# EAGLE design 02 (EAGLE 6.6.0)
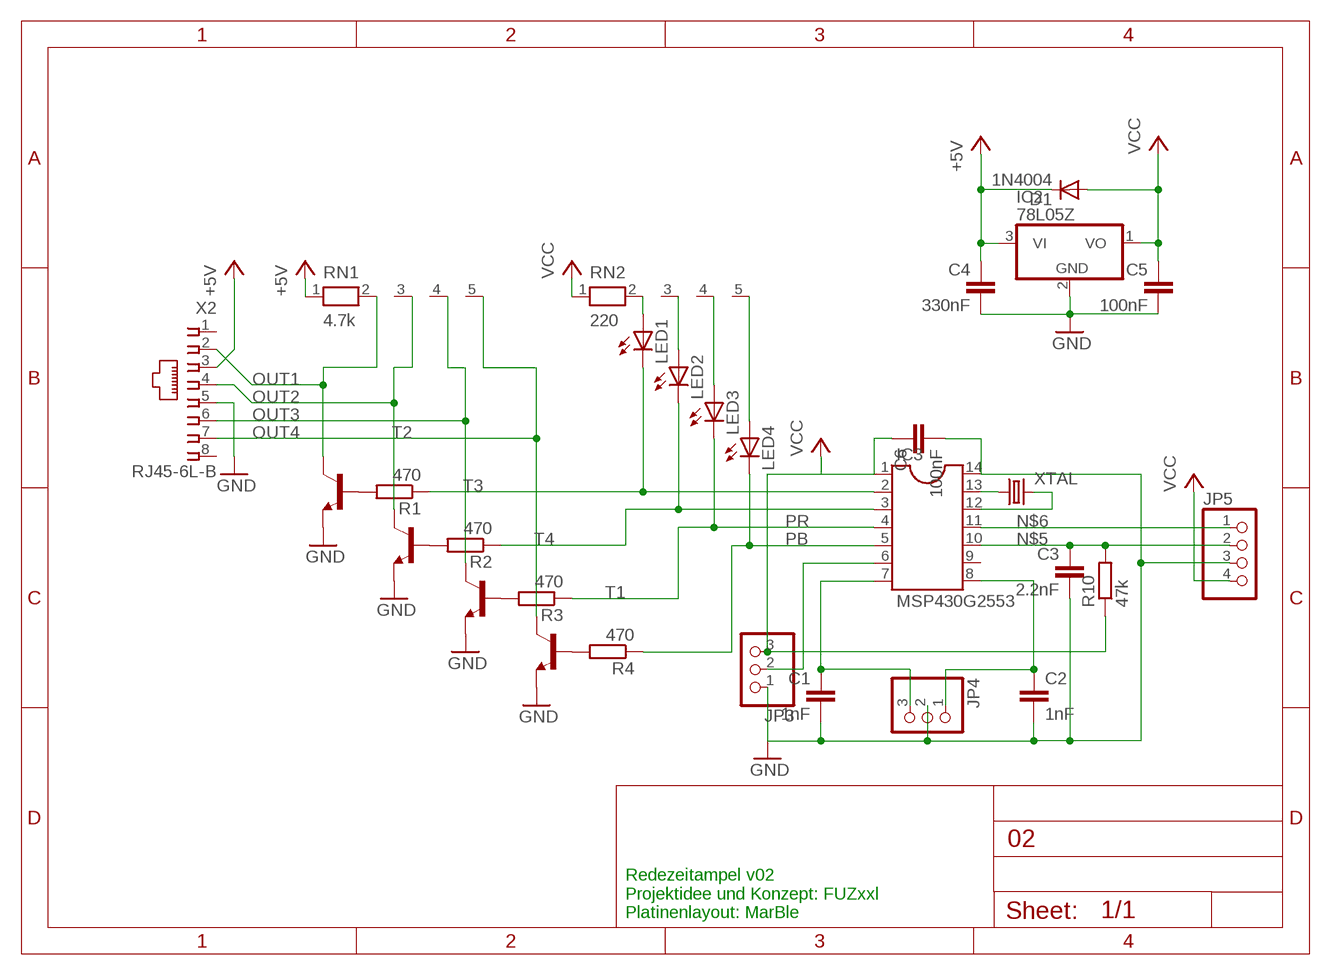
[diagram p0: schematic, sheet 1]

## Parts
C1  1nF  C-EU025-024X044  [C025-024X044]
C2  1nF  C-EU025-024X044  [C025-024X044]
C3  2.2nF  C-EU025-024X044  [C025-024X044]
C4  330nF  C-EU050-024X044  [C050-024X044]
C5  100nF  C-EU050-024X044  [C050-024X044]
C6  100nF  C-EU050-024X044  [C050-024X044]
D1  1N4004  [DO41-10]
IC2  78L05Z  [TO92]
IC3  MSP430G2553  DIL14S  [SOCKET-14]
JP3  PINHD-1X3  [1X03]
JP4  PINHD-1X3  [1X03]
JP5  PINHD-1X4  [1X04]
LED1  LED5MM  [LED5MM]
LED2  LED5MM  [LED5MM]
LED3  LED5MM  [LED5MM]
LED4  LED5MM  [LED5MM]
R1  470  R-EU_0207/12  [0207/12]
R2  470  R-EU_0207/12  [0207/12]
R3  470  R-EU_0207/12  [0207/12]
R4  470  R-EU_0207/12  [0207/12]
R10  47k  R-EU_0207/7  [0207/7]
RN1  4.7k  RN04  [RN-5]
RN2  220  RN04  [RN-5]
T1  -NPN-TO92-EBC  [TO92-EBC]
T2  -NPN-TO92-EBC  [TO92-EBC]
T3  -NPN-TO92-EBC  [TO92-EBC]
T4  -NPN-TO92-EBC  [TO92-EBC]
X2  RJ45-6L-B  [RJ45-NO-SHIELD]
XTAL  CRYSTALTC26H  [TC26H]

## Nets
+5V: C4.1 D1.C IC2.3(VI) RN1.1 X2.3
GND: C1.2 C2.2 C3.2 C4.2 C5.2 C6.2 IC2.2(GND) IC3.14 JP3.1 JP4.2 JP5.3 T1.E T2.E T3.E T4.E X2.5
N$1: IC3.6 JP3.2
N$2: IC3.13 XTAL.1
N$3: C1.1 IC3.7 JP4.3
N$4: C2.1 IC3.8 JP4.1
N$5: C3.1 IC3.10 JP5.2 R10.2
N$6: IC3.11 JP5.1
N$7: IC3.12 XTAL.2
N$8: LED1.A RN2.2
N$9: IC3.3 LED2.K(C) R2.1
N$10: LED2.A RN2.3
N$11: R4.2 T1.B
N$12: IC3.2 LED1.K(C) R1.1
N$13: LED3.A RN2.4
N$14: LED4.A RN2.5
N$16: R1.2 T2.B
N$20: R2.2 T3.B
N$23: R3.2 T4.B
OUT1: RN1.2 T2.C X2.2
OUT2: RN1.3 T3.C X2.4
OUT3: RN1.4 T4.C X2.6
OUT4: RN1.5 T1.C X2.7
PB: IC3.5 LED4.K(C) R4.1
PR: IC3.4 LED3.K(C) R3.1
VCC: C5.1 C6.1 D1.A IC2.1(VO) IC3.1 JP3.3 JP5.4 R10.1 RN2.1
Unconnected: IC3.9 X2.1 X2.8

## Notes on the sheet
- Redezeitampel v02
  Projektidee und Konzept: FUZxxl
  Platinenlayout: MarBle

## Library data of the parts
C1-C6 = rcl:C-EU: CAPACITOR, European symbol
D1 = adafruit:1N4004: DIODE General purpose 1N400x type rectifier (With bigger pads) http://www.ladyada.net/library/pcb/eaglelibrary.html
IC2 = linear:78*: Positive VOLTAGE REGULATOR Source: http://cache.national.com/ds/LM/LM78L05.pdf http://www.fairchildsemi.com/ds/LM/LM7805.pdf
IC3 = ic-package:DIL14: Dual In Line / Socket
JP3 JP4 = pinhead:PINHD-1X3: PIN HEADER
JP5 = pinhead:PINHD-1X4: PIN HEADER
LED1-LED4 = led:LED: LED OSRAM: - CHIPLED LG R971, LG N971, LY N971, LG Q971, LY Q971, LO R971, LY R971 LH N974, LH R974 LS Q976, LO Q976, LY Q976 LO Q996 - Hyper CHIPLED LW Q18S LB Q993, LB Q99A, LB R99A - SideLED LS A670, LO A670, LY A670, LG A670, LP A670 LB A673, LV A673, LT A673, LW A673 LH A674 LY A675 LS A676, LA A676, LO A676, LY A676, LW A676 LS A679, LY A679, LG A679 - Hyper Micro SIDELED® LS Y876, LA Y876, LO Y876, LY Y876 LT Y87S - SmartLED LW L88C, LW L88S LB L89C, LB L89S, LG L890 LS L89K, LO L89K, LY L89K LS L896, LA L896, LO L896, LY L896 - TOPLED LS T670, LO T670, LY T670, LG T670, LP T670 LSG T670, LSP T670, LSY T670, LOP T670, LYG T670 LG T671, LOG T671, LSG T671 LB T673, LV T673, LT T673, LW T673 LH T674 LS T676, LA T676, LO T676, LY T676, LB T676, LH T676, LSB T676, LW T676 LB T67C, LV T67C, LT T67C, LS T67K, LO T67K, LY T67K, LW E67C LS E67B, LA E67B, LO E67B, LY E67B, LB E67C, LV E67C, LT E67C LW T67C LS T679, LY T679, LG T679 LS T770, LO T770, LY T770, LG T770, LP T770 LB T773, LV T773, LT T773, LW T773 LH T774 LS E675, LA E675, LY E675, LS T675 LS T776, LA T776, LO T776, LY T776, LB T776 LHGB T686 LT T68C, LB T68C - Hyper Mini TOPLED® LB M676 - Mini TOPLED Santana® LG M470 LS M47K, LO M47K, LY M47K Source: http://www.osram.convergy.de LUXEON: - LUMILED® LXK2-PW12-R00, LXK2-PW12-S00, LXK2-PW14-U00, LXK2-PW14-V00 LXK2-PM12-R00, LXK2-PM12-S00, LXK2-PM14-U00 LXK2-PE12-Q00, LXK2-PE12-R00, LXK2-PE12-S00, LXK2-PE14-T00, LXK2-PE14-U00 LXK2-PB12-K00, LXK2-PB12-L00, LXK2-PB12-M00, LXK2-PB14-N00, LXK2-PB14-P00, LXK2-PB14-Q00 LXK2-PR12-L00, LXK2-PR12-M00, LXK2-PR14-Q00, LXK2-PR14-R00 LXK2-PD12-Q00, LXK2-PD12-R00, LXK2-PD12-S00 LXK2-PH12-R00, LXK2-PH12-S00 LXK2-PL12-P00, LXK2-PL12-Q00, LXK2-PL12-R00 Source: www.luxeon.com KINGBRIGHT: KA-3528ASYC Source: www.kingbright.com
R1-R4 R10 = rcl:R-EU_: RESISTOR, European symbol
RN1 RN2 = resistor-net:RN04: RESISTOR NETWORK; OC_FARNELL: unknown; OC_NEWARK: unknown
T1-T4 = transistor:*-NPN-: NPN Transistror BF959 corrected 2008.03.06
X2 = con-tycoelectronics:RJ45: CORCOM Modular RJ Jacks No Shield Source: www.tycoelectronics.com .. ENG_DS_1654001_1099_RJ_L_0507.pdf; MPN: RJ45-6L-B; OC_FARNELL: unknown; OC_NEWARK: 16R6090
XTAL = crystal:CRYSTAL: CRYSTAL; OC_FARNELL: unknown; OC_NEWARK: unknown

## Board
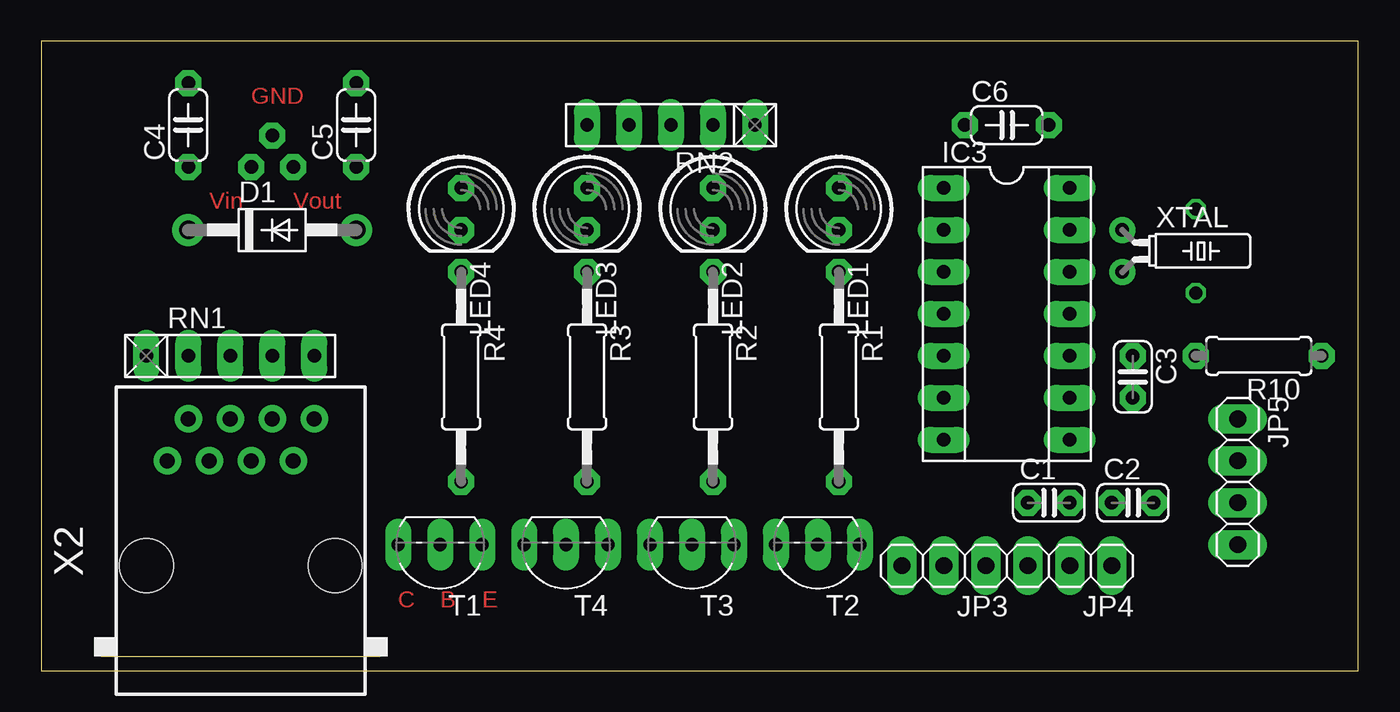
[diagram p1: board, top side]
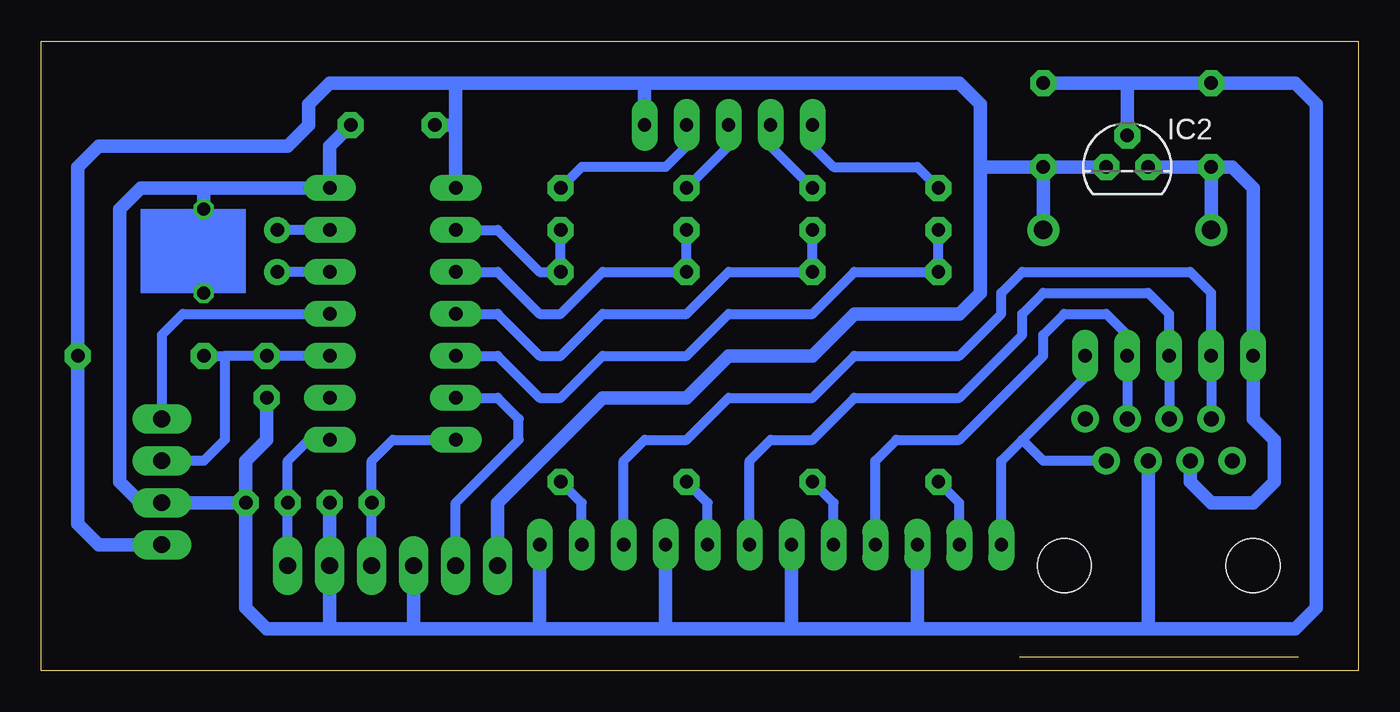
[diagram p2: board, bottom side, seen from below]

Size 79.68 x 38.09 mm. Coordinates in mm from the lower left corner, seen from the top.
Outline: 0,0 79.68,0 79.68,38.09 0,38.09 0,0
Copper layers (1*16): Top 0.035mm / dielectric 1.5mm / Bottom 0.035mm
Design rules "default *": minimum track width 10mil, minimum drill 24mil, track to track 10mil, track to pad 10mil, pad to pad 10mil, via to via 10mil, smd to smd 8mil, copper to edge 40mil, drill to drill 8mil, minimum pad ring 10mil, minimum via ring 8mil, stop-mask expansion 4mil, vias tented up to drill 0mil, thermal gap 10mil

### Footprints (pad centres in the part's own frame; a part is rotated, then mirrored left to right if it is on the bottom)
C025-024X044 = drill 0.813 octagon: 1 -1.27,0; 2 1.27,0
C050-024X044 = drill 0.813 octagon: 1 -2.54,0; 2 2.54,0
DO41-10 = drill 1.118 pad 1.93: A 5.08,0; C -5.08,0
TO92 = drill 0.813 octagon: 1 -1.27,0; 2 0,1.905; 3 1.27,0
SOCKET-14 = drill 0.813 long: 1 -7.62,-3.81; 2 -5.08,-3.81; 3 -2.54,-3.81; 4 0,-3.81; 5 2.54,-3.81; 6 5.08,-3.81; 7 7.62,-3.81; 8 7.62,3.81; 9 5.08,3.81; 10 2.54,3.81; 11 0,3.81; 12 -2.54,3.81; 13 -5.08,3.81; 14 -7.62,3.81
1X03 = drill 1.016 long: 1 -2.54,0; 2 0,0; 3 2.54,0
1X04 = drill 1.016 long: 1 -3.81,0; 2 -1.27,0; 3 1.27,0; 4 3.81,0
LED5MM = drill 0.813 octagon: A -1.27,0; K 1.27,0
0207/12 = drill 0.813 octagon: 1 -6.35,0; 2 6.35,0
0207/7 = drill 0.813 octagon: 1 -3.81,0; 2 3.81,0
RN-5 = drill 0.813 long: 1 -5.08,0; 2 -2.54,0; 3 0,0; 4 2.54,0; 5 5.08,0
TO92-EBC = drill 0.813 long: B 0,-1.27; C 2.54,-1.27; E -2.54,-1.27
RJ45-NO-SHIELD = drill 0.9 pad 1.4: 1 -4.445,6.35; 2 -3.175,8.89; 3 -1.905,6.35; 4 -0.635,8.89; 5 0.635,6.35; 6 1.905,8.89; 7 3.175,6.35; 8 4.445,8.89 | hole 3.251: -5.715,0; 5.715,0
TC26H = drill 0.813: 1 -1.27,0; 2 1.27,0

### Placement (x,y rotation side)
C1  60.96,10.16 0 top
C2  66.04,10.16 0 top
C3  66.04,17.78 270 top
C4  8.89,33.02 90 top
C5  19.05,33.02 90 top
C6  58.42,33.02 0 top
D1  13.97,26.67 0 top
IC2  13.97,30.48 0 bottom
IC3  58.42,21.59 270 top
JP3  54.61,6.35 180 top
JP4  62.23,6.35 180 top
JP5  72.39,11.43 270 top
LED1  48.26,27.94 270 top
LED2  40.64,27.94 270 top
LED3  33.02,27.94 270 top
LED4  25.4,27.94 270 top
R1  48.26,17.78 270 top
R2  40.64,17.78 270 top
R3  33.02,17.78 270 top
R4  25.4,17.78 270 top
R10  73.66,19.05 180 top
RN1  11.43,19.05 0 top
RN2  38.1,33.02 180 top
T1  24.13,6.35 180 top
T2  46.99,6.35 180 top
T3  39.37,6.35 180 top
T4  31.75,6.35 180 top
X2  12.06,6.35 0 top
XTAL  65.41,25.4 270 top

### Tracks (layer width: path | path; a pad name or v marks a point on that pad's centre or on a via)
+5V
  Bottom 0.813: X2.3 10.16,11.43 8.89,10.16 6.35,10.16 5.08,11.43 5.08,13.97 6.35,15.24 RN1.1 6.35,29.21 7.62,30.48 C4.1 | IC2.3 C4.1 | D1.C C4.1
GND  (via drill 0.8)
  Bottom 0.813: IC2.2 13.97,35.56 | 62.23,2.54 57.15,2.54 | 57.15,2.54 JP3.1 | C2.2 67.31,3.81 66.04,2.54 62.23,2.54 | T2.E 49.53,2.54 | 49.53,2.54 57.15,2.54 | 12.7,2.54 3.81,2.54 2.54,3.81 2.54,34.29 3.81,35.56 C4.2 13.97,35.56 | 12.7,2.54 26.67,2.54 | 26.67,2.54 34.29,2.54 | 34.29,2.54 41.91,2.54 | 41.91,2.54 49.53,2.54 | T1.E 26.67,2.54 | T4.E 34.29,2.54 | T3.E 41.91,2.54 | 62.23,2.54 JP4.2 C1.2 | 69.85,29.21 73.66,29.21 74.93,27.94 74.93,11.43 73.66,10.16 JP5.3 C2.2 | 69.85,29.21 v69.85,27.94 v69.85,22.86 | X2.5 12.7,2.54 | 69.85,29.21 IC3.14 62.23,31.75 C6.2 | C3.2 66.04,13.97 67.31,12.7 C2.2 | 13.97,35.56 C5.2
N$1
  Bottom 0.61: JP3.2 54.61,10.16 50.8,13.97 50.8,15.24 52.07,16.51 IC3.6
N$2
  Bottom 0.61: IC3.13 XTAL.1
N$3
  Bottom 0.61: JP4.3 C1.1 59.69,12.7 58.42,13.97 IC3.7
N$4
  Bottom 0.61: JP4.1 C2.1 64.77,12.7 63.5,13.97 IC3.8
N$5
  Bottom 0.61: 68.58,19.05 C3.1 IC3.10 | R10.2 68.58,19.05 | 68.58,19.05 68.58,13.97 69.85,12.7 JP5.2
N$6
  Bottom 0.61: IC3.11 71.12,21.59 72.39,20.32 JP5.1
N$7
  Bottom 0.61: IC3.12 XTAL.2
N$8
  Bottom 0.61: RN2.2 40.64,31.75 41.91,30.48 46.99,30.48 LED1.A
N$9
  Bottom 0.61: LED2.K R2.1 45.72,24.13 48.26,21.59 49.53,21.59 52.07,24.13 IC3.3
N$10
  Bottom 0.61: LED2.A 38.1,31.75 RN2.3
N$11
  Bottom 0.61: T1.B 24.13,10.16 R4.2
N$12
  Bottom 0.61: LED1.K R1.1 49.53,24.13 52.07,26.67 IC3.2
N$13
  Bottom 0.61: RN2.4 35.56,31.75 LED3.A
N$14
  Bottom 0.61: RN2.5 33.02,31.75 31.75,30.48 26.67,30.48 LED4.A
N$16
  Bottom 0.61: T2.B 46.99,10.16 R1.2
N$20
  Bottom 0.61: T3.B 39.37,10.16 R2.2
N$23
  Bottom 0.61: T4.B 31.75,10.16 R3.2
OUT1
  Bottom 0.61: T2.C 44.45,12.7 43.18,13.97 40.64,13.97 38.1,16.51 33.02,16.51 30.48,19.05 24.13,19.05 21.59,21.59 21.59,22.86 20.32,24.13 10.16,24.13 8.89,22.86 RN1.2 X2.2
OUT2
  Bottom 0.61: T3.C 36.83,12.7 35.56,13.97 33.02,13.97 30.48,16.51 24.13,16.51 20.32,20.32 20.32,21.59 19.05,22.86 12.7,22.86 11.43,21.59 RN1.3 X2.4
OUT3
  Bottom 0.61: T4.C 29.21,12.7 27.94,13.97 24.13,13.97 19.05,19.05 19.05,20.32 17.78,21.59 15.24,21.59 13.97,20.32 RN1.4 X2.6
OUT4
  Bottom 0.61: T1.C 21.59,12.7 20.32,13.97 | X2.7 19.05,12.7 20.32,13.97 | 20.32,13.97 16.51,17.78 RN1.5
PB
  Bottom 0.61: LED4.K R4.1 30.48,24.13 33.02,21.59 38.1,21.59 40.64,19.05 45.72,19.05 48.26,16.51 49.53,16.51 52.07,19.05 IC3.5
PR
  Bottom 0.61: LED3.K R3.1 38.1,24.13 40.64,21.59 45.72,21.59 48.26,19.05 49.53,19.05 52.07,21.59 IC3.4
VCC
  Bottom 0.813: JP3.3 52.07,10.16 45.72,16.51 40.64,16.51 38.1,19.05 33.02,19.05 30.48,21.59 24.13,21.59 22.86,22.86 22.86,30.48 | 54.61,35.56 62.23,35.56 63.5,34.29 63.5,33.02 64.77,31.75 76.2,31.75 77.47,30.48 R10.1 77.47,8.89 76.2,7.62 JP5.4 | 43.18,35.56 24.13,35.56 22.86,34.29 22.86,30.48 | 43.18,35.56 RN2.1 43.18,34.29 | 54.61,35.56 43.18,35.56 | IC3.1 54.61,33.02 | 54.61,33.02 54.61,35.56 | C6.1 54.61,33.02 | IC2.1 C5.1 | C5.1 22.86,30.48 | D1.A C5.1
(copper drawn outside any net)
  shapes: Bottom area x1

### Text on the board
Top: GND | Vin | Vout | C | B | E